# Altium schematic sheet HIVE_BOARD_MCU.SchDoc
size Tabloid; DocumentNumber: 2; SheetNumber: 3; SheetTotal: 3; Sheet_Name: Channel; Size: 11x17
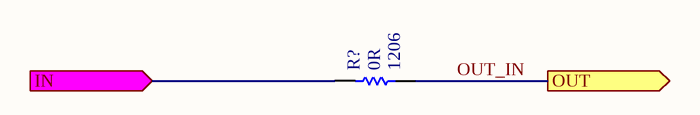
[diagram p0: HIVE_BOARD_MCU.SchDoc]

## Parts
R?  value 0R  Package: 1206  [RES_1206]  (hidden comment: RC3216J000CS)

## Ports
IN (in), OUT (out)

## Nets
IN: R?.2 ; port IN
OUT_IN: R?.1 ; port OUT

## Notes on the sheet
- Sheet Name
- Project Title
- Global Project
- Revision
- Size
- Date
- Group
- Sheet
- of
- Filename
- Designers

## Library data of the parts
R? = RES_RC3216J000CS: RES - 0 OHM 1/4W - 1206; Manufacturer #1: Samsung Electro-Mechanics; Voltage Rating: 200V; GRAMS Lib Spec: 2.8; Magnetic Material: UNKNOWN; Polarized: NO; Tolerance: N/A; Current Rating: *; Power Max: 1/4W; HelpURL: http://www.samsungsem.com/kr/support/product-search/chip-resistor/RC3216J000CS.jsp; CreatedBy/Date: Arnaud Samson 12/07/18; VerifiedBy: Jonathan Bouchard 2018-07-13; Temperature: -55°C ~ 155°C; Manufacturer #2: *; Note: *; Assembly Type: SMD; Part Number #2: *; Part Number #1: RC3216J000CS; Supplier 1: Digi-Key; Supplier Part Number 1: 1276-3514-1-ND